# EAGLE design PrimeTime (EAGLE 7.6.0)
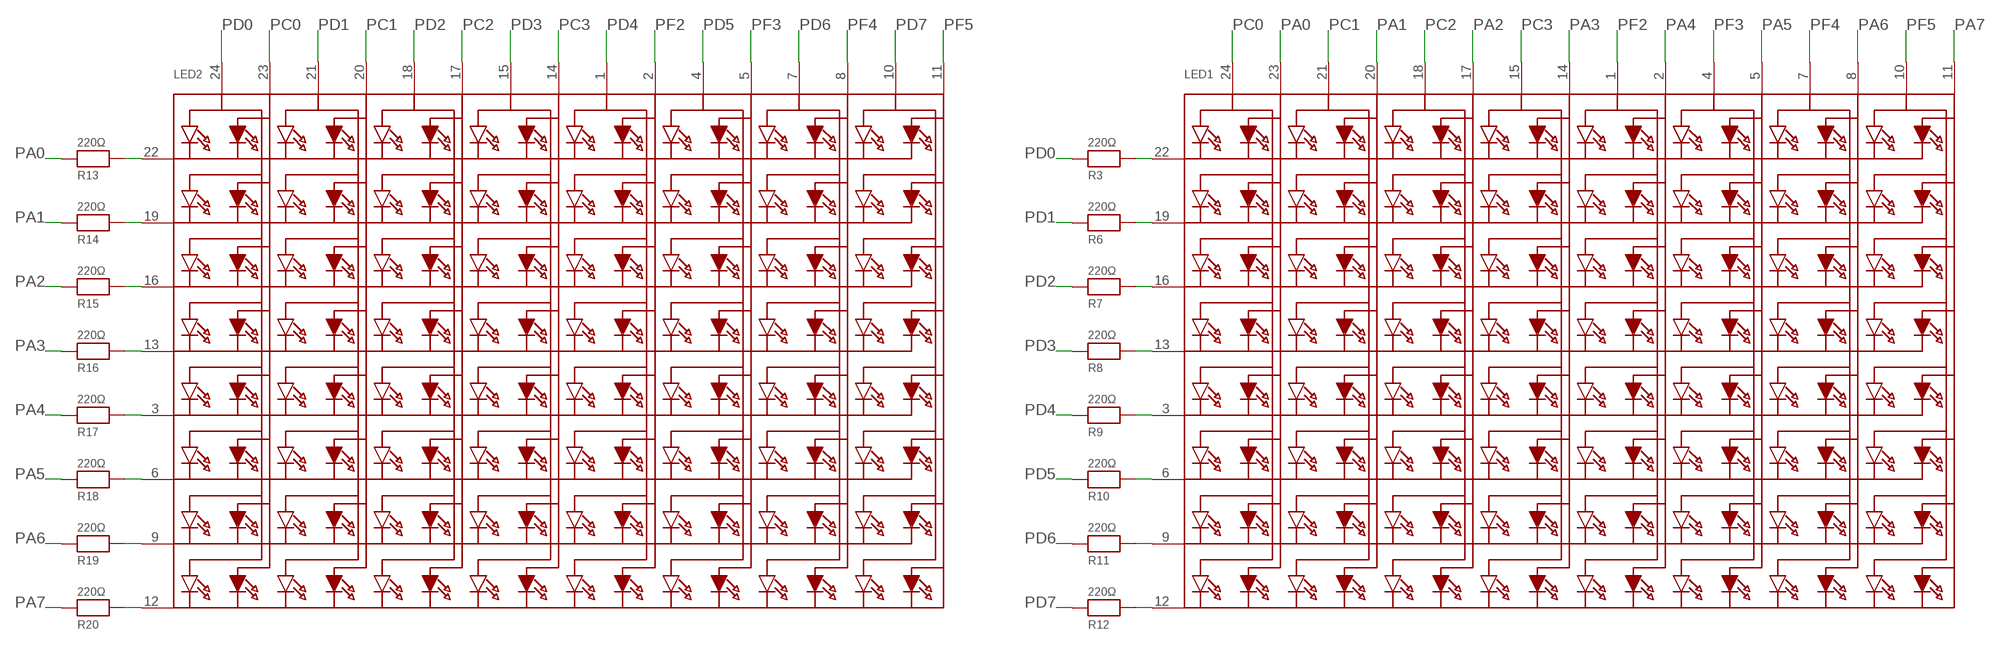
[diagram p0: schematic, sheet 1, part 1 of 2]
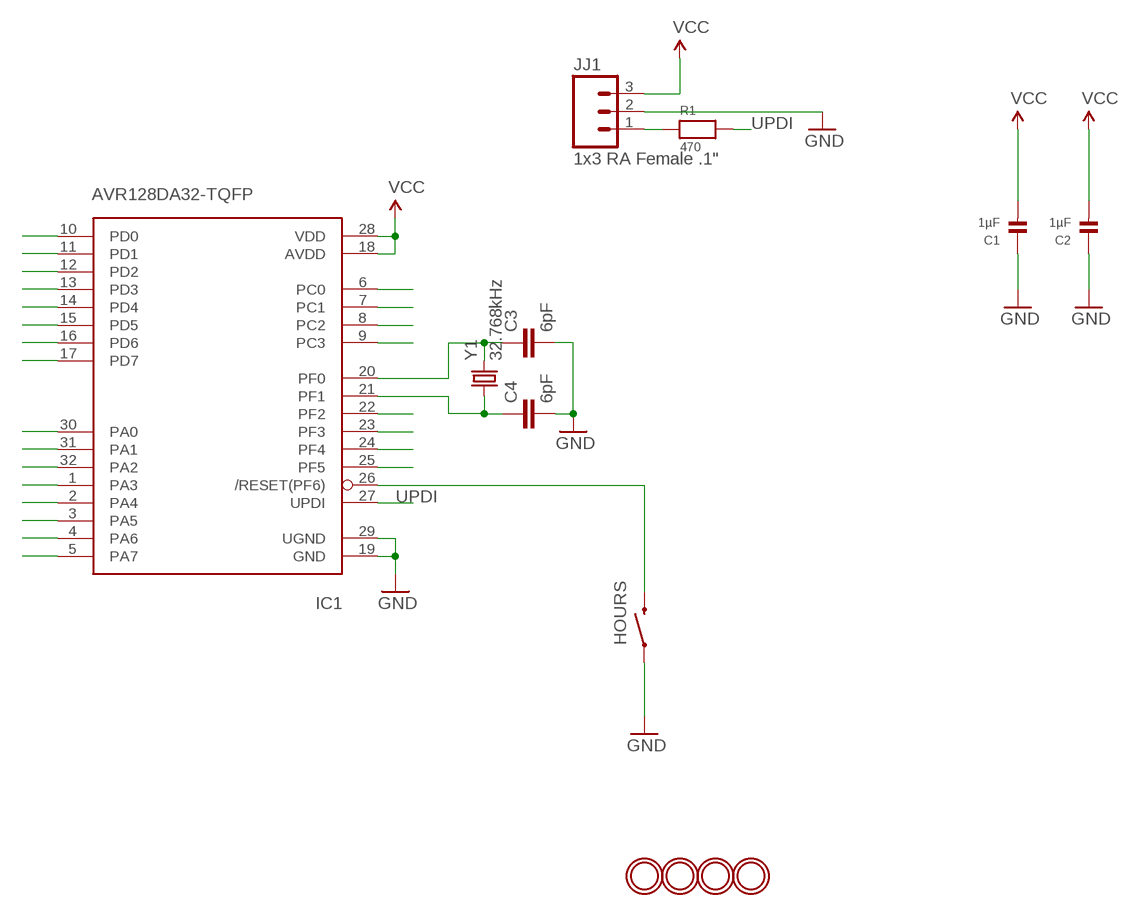
[diagram p1: schematic, sheet 1, part 2 of 2]

## Parts
C1  1µF  CAP_CERAMIC_0805MP  [_0805MP]
C2  1µF  CAP_CERAMIC_0805MP  [_0805MP]
C3  6pF  CAP0805  [0805]
C4  6pF  CAP0805  [0805]
HOURS  SWITCH-MOMENTARY-2SMD-4  [TACTILE_SWITCH_TALL]
IC1  AVR128DA32-TQFP  [TQFP32-08]
JJ1  1x3 RA Female .1"  M03SMD_RA_FEMALE  [1X03_SMD_RA_FEMALE]
LED1  SEGMENT_8X8_BICOLOR_ROWCATHODEMI2A883XX  [SEGMENT_BICOL_BL-M12A883XX]
LED2  SEGMENT_8X8_BICOLOR_ROWCATHODEMI2A883XX  [SEGMENT_BICOL_BL-M12A883XX]
R1  470  RESISTOR_0805MP  [_0805MP]
R3  220Ω  RESISTOR_0805MP  [_0805MP]
R6  220Ω  RESISTOR_0805MP  [_0805MP]
R7  220Ω  RESISTOR_0805MP  [_0805MP]
R8  220Ω  RESISTOR_0805MP  [_0805MP]
R9  220Ω  RESISTOR_0805MP  [_0805MP]
R10  220Ω  RESISTOR_0805MP  [_0805MP]
R11  220Ω  RESISTOR_0805MP  [_0805MP]
R12  220Ω  RESISTOR_0805MP  [_0805MP]
R13  220Ω  RESISTOR_0805MP  [_0805MP]
R14  220Ω  RESISTOR_0805MP  [_0805MP]
R15  220Ω  RESISTOR_0805MP  [_0805MP]
R16  220Ω  RESISTOR_0805MP  [_0805MP]
R17  220Ω  RESISTOR_0805MP  [_0805MP]
R18  220Ω  RESISTOR_0805MP  [_0805MP]
R19  220Ω  RESISTOR_0805MP  [_0805MP]
R20  220Ω  RESISTOR_0805MP  [_0805MP]
U$1  MOUNTINGHOLE2.5  [MOUNTINGHOLE_2.5_PLATED]
U$4  MOUNTINGHOLE2.5  [MOUNTINGHOLE_2.5_PLATED]
U$5  MOUNTINGHOLE2.5  [MOUNTINGHOLE_2.5_PLATED]
U$9  MOUNTINGHOLE2.5  [MOUNTINGHOLE_2.5_PLATED]
Y1  32.768kHz  CRYSTAL3.2X1.5MM  [CRYSTAL-SMD-3.2X1.5MM]

## Nets
GND: C1.1 C2.1 C3.2 C4.2 HOURS.A2 IC1.19(GND) IC1.29(UGND) JJ1.2
N$2: LED2.22(K1) R13.2
N$3: LED2.19(K2) R14.2
N$4: LED2.16(K3) R15.2
N$5: LED2.13(K4) R16.2
N$6: LED2.3(K5) R17.2
N$7: LED2.6(K6) R18.2
N$8: LED2.9(K7) R19.2
N$9: LED2.12(K8) R20.2
N$10: HOURS.B2 IC1.26(/RESET(PF6))
N$11: LED1.22(K1) R3.2
N$12: LED1.19(K2) R6.2
N$13: LED1.16(K3) R7.2
N$14: LED1.13(K4) R8.2
N$15: LED1.3(K5) R9.2
N$16: LED1.6(K6) R10.2
N$17: LED1.9(K7) R11.2
N$18: LED1.12(K8) R12.2
N$40: C4.1 IC1.21(PF1) Y1.P$1
N$42: C3.1 IC1.20(PF0) Y1.P$2
N$78: JJ1.1 R1.1
PA0: IC1.30(PA0) LED1.23(A2) R13.1
PA1: IC1.31(PA1) LED1.20(A4) R14.1
PA2: IC1.32(PA2) LED1.17(A6) R15.1
PA3: IC1.1(PA3) LED1.14(A8) R16.1
PA4: IC1.2(PA4) LED1.2(A10) R17.1
PA5: IC1.3(PA5) LED1.5(A12) R18.1
PA6: IC1.4(PA6) LED1.8(A14) R19.1
PA7: IC1.5(PA7) LED1.11(A16) R20.1
PC0: IC1.6(PC0) LED1.24(A1) LED2.23(A2)
PC1: IC1.7(PC1) LED1.21(A3) LED2.20(A4)
PC2: IC1.8(PC2) LED1.18(A5) LED2.17(A6)
PC3: IC1.9(PC3) LED1.15(A7) LED2.14(A8)
PD0: IC1.10(PD0) LED2.24(A1) R3.1
PD1: IC1.11(PD1) LED2.21(A3) R6.1
PD2: IC1.12(PD2) LED2.18(A5) R7.1
PD3: IC1.13(PD3) LED2.15(A7) R8.1
PD4: IC1.14(PD4) LED2.1(A9) R9.1
PD5: IC1.15(PD5) LED2.4(A11) R10.1
PD6: IC1.16(PD6) LED2.7(A13) R11.1
PD7: IC1.17(PD7) LED2.10(A15) R12.1
PF2: IC1.22(PF2) LED1.1(A9) LED2.2(A10)
PF3: IC1.23(PF3) LED1.4(A11) LED2.5(A12)
PF4: IC1.24(PF4) LED1.7(A13) LED2.8(A14)
PF5: IC1.25(PF5) LED1.10(A15) LED2.11(A16)
UPDI: IC1.27(UPDI) R1.2
VCC: C1.2 C2.2 IC1.18(AVDD) IC1.28(VDD) JJ1.3

## Library data of the parts
C1 C2 = microbuilder:CAP_CERAMIC: Ceramic Capacitors 0402 - 0402 Surface Mount Capacitors 16pF 50V 5% [Digikey: 445-4899-2-ND] 18pF 50V 5% [Digikey: 490-1281-2-ND] 22pF 50V 5% [Digikey: 490-1283-2-ND] 68pF 50V 5% [Digikey: 490-1289-2-ND] 0.1uF 10V 10% [Digikey: 490-1318-2-ND] 1.0uF 6.3V 10% [Digikey: 490-1320-2-ND] 0603 - 0603 Surface Mount Capacitors 16 pF 50V 5% [Digikey: 445-5051-2-ND] 22 pF 50V [Digikey: PCC220ACVTR-ND] 33 pF 50V 5% [Digikey: 490-1415-1-ND] 56pF 50V 5% [Digikey: 490-1421-1-ND] 220pF 50V 5% [Digikey: 445-1285-1-ND] 680 pF 50V 2200 pF 50V 5% C0G [Digikey: 445-1297-1-ND] 5600 pF 100V 5% X7R [Digikey: 478-3711-1-ND] 0.1 µF 25V 10% [Digikey: PCC2277TR-ND] 0.22 µF 16V 10% X7R [Digikey: 445-1318-1-ND] 1.0 µF 25V 10% [Digikey: 445-5146-2-ND] 0603 - RF Specific 3pF 250V +/-0.1pF RF [Digikey: 712-1347-1-ND] 18 pF 250V 5% [Digikey: 478-3505-1-ND or 712-1322-1-ND] 56 pF 250V 5% C0G RF [Digikey: 490-4867-1-ND] 68 pF 250V RF [Digikey: 490-4868-1-ND] 0805 - 0805 Surface Mount Capacitors 220 pF 250V 2% RF Ceramic Capacitor [Digikey: 712-1398-1-ND] 1000 pF 50V 2% NP0 Ceramic Capacitor [Digikey: 478-3760-1-ND] 0.1 µF 25V 10% Ceramic Capacitor [Digikey: PCC1828TR-ND] 1.0 µF 16V 10% Ceramic Capacitor[Digikey: 490-1691-2-ND] 10.0 µF 10V 10% Ceramic Capacitor[Digikey: 709-1228-1-ND] 10.0 uF 16V 10% Ceramic Capacitor [Digikey: 478-5165-2-ND] 47 uF 6.3V 20% Ceramic Capacitor [Digikey: 587-1779-1-ND or 399-5506-1-ND] 1206 - 1206 Surface Mount Capacitors 47uF 10V 20% Ceramic Capacitor [Digikey: 490-5528-1-ND or 399-5508-1-ND or 445-6010-1-ND] 100uF 6.3V -20%, +80% Y5V Ceramic Capacitor (Digikey: 490-4512-1-ND, Mouser: 81-GRM31CF50J107ZE1L)
C3 C4 = SparkFun-Capacitors:CAP: Capacitor Standard 0603 ceramic capacitor, and 0.1" leaded capacitor.
HOURS = SparkFun-Electromechanical:SWITCH-MOMENTARY-2: Various NO switches- pushbuttons, reed, etc; PROD_ID: SWCH-11966
IC1 = technoblogy:AVR128DA32: ATmega32u2 Pin compatible with the atmega8u2, atmega16u2 and atmega32u2 8, 16 or 32 K flash, 1K RAM, 512b EEPROM 8 bit and 16 bit timer (5 PWM total) UART, SPI (no I2C!) USB with 4 endpoints, LUFA compatible 22 I/O lines, analog comparator (no ADC!) Comes with DFU bootloader burned in!
JJ1 = SparkFun-Connectors:M03: Header 3 Standard 3-pin 0.1" header. Use with straight break away headers (SKU : PRT-00116), right angle break away headers (PRT-00553), swiss pins (PRT-00743), machine pins (PRT-00117), and female headers (PRT-00115). Molex polarized connector foot print use with SKU : PRT-08232 with associated crimp pins and housings.; PROD_ID: CONN-10926
LED1 LED2 = adafruit:SEGMENT_8X8_BICOLOR_ROWCATHODE: 8x8 Bi-Color LED Segment Displays: Row = Cathode 1.2" Bi-Color 8x8 Matrix, 3.0mm Square LEDs - BL-M12A883XX
R1 R3 R6-R20 = microbuilder:RESISTOR: Resistors 0402 - 0402 Surface Mount Package 22 Ohm 1% 1/16W [Digikey: 311-22.0LRTR-ND] 33 Ohm 5% 1/16W 1.0K 5% 1/16W 1.5K 5% 1/16W 2.0K 1% 1/16W 10.0K 1% 1/16W [Digikey: 311-10.0KLRTR-ND] 10.0K 5% 1/16W [Digikey: RMCF0402JT10K0TR-ND] 12.1K 1% 1/16W [Digikey: 311-22.0LRTR-ND] 100.0K 5% 1/16W 0603 - 0603 Surface Mount Package 0 Ohm 1/10 Watt 1% Resistor 15 Ohm 1/10 Watt 1% Resistor 33 Ohm 1/10 Watt 1% Resistor 49.9 Ohm 1/10 Watt 1% Resistor 100 Ohm 1/10 Watt 1% Resistor 150 Ohm 1/10 Watt 1% Resistor 240 Ohm 1/10 Watt 1% Resistor 390 Ohm 1/10 Watt 1% Resistor 560 Ohm 1/10 Watt 1% Resistor 680 Ohm 1/10 Watt 1% Resistor 750 Ohm 1/10 Watt 1% Resistor 1.0K Ohm 1/10 Watt 1% Resistor 1.5K Ohm 1/10 Watt 1% Resistor 2.0K Ohm 1/10 Watt 1% Resistor 2.2K Ohm 1/10 Watt 1% Resistor 3.3K Ohm 1/10 Watt 1% Resistor 4.7K Ohm 1/10 Watt 1% Resistor 10.0K Ohm 1/10 Watt 1% Resistor 12.0K Ohm 1/10 Watt 1% Resistor 12.1K Ohm 1/10 Watt 1% Resistor 20.0K Ohm 1/10 Watt 1% Resistor 33.0K Ohm 1/10 Watt 1% Resistor 100.0K Ohm 1/10 Watt 1% Resistor 0805 - 0805 Surface Mount Package 0 Ohm 1/8 Watt 1% Resistor 33 Ohm 1/8 Watt 1% Resistor 100 Ohm 1/8 Watt 1% Resistor 150 Ohm 1/8 Watt 1% Resistor 200 Ohm 1/8 Watt 1% Resistor 240 Ohm 1/8 Watt 1% Resistor 330 Ohm 1/8 Watt 1% Resistor 390 Ohm 1/8 Watt 1% Resistor 470 Ohm 1/8 Watt 1% Resistor 1.0K Ohm 1/8 Watt 1% Resistor 1.5K Ohm 1/8 Watt 1% Resistor 2.0K Ohm 1/8 Watt 1% Resistor 4.7K Ohm 1/8 Watt 1% Resistor 5.1K Ohm 1/8 Watt 1% Resistor 5.6K Ohm 1/8 Watt 1% Resistor 10.0K Ohm 1/8 Watt 1% Resistor 22.0K Ohm 1/8 Watt 1% Resistor 33.0K Ohm 1/8 Watt 1% Resistor 100K Ohm 1/8 Watt 1% Resistor 1206 - 1206 Surface Mount Package 2012 - 2010 Surface Mount Package 0.11 Ohm 1/2 Watt 1% Resistor - Digikey: RHM.11UCT-ND
U$1 U$4 U$5 U$9 = microbuilder:MOUNTINGHOLE: Mounting Hole For #2 screws (0.086"/2.18mm width, 0.094"/2.4mm hole) use 2.5mm; BOM: EXCLUDE
Y1 = SparkFun-FreqCtrl:CRYSTAL: Various standard crystals. Proven footprints.; PROD_ID: XTAL-13062

## Net classes
0 default: width 0.152 mm, drill 0.305 mm, clearance 0.152 mm

## Board
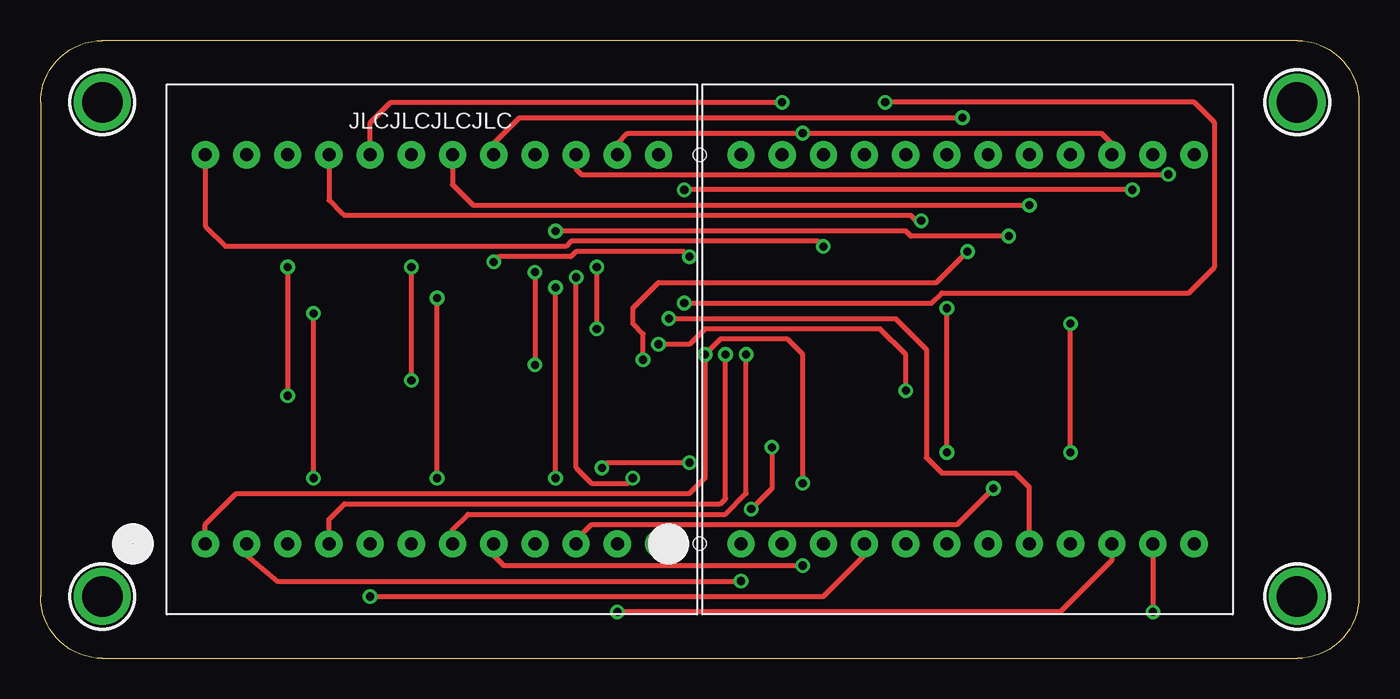
[diagram p2: board, top side]
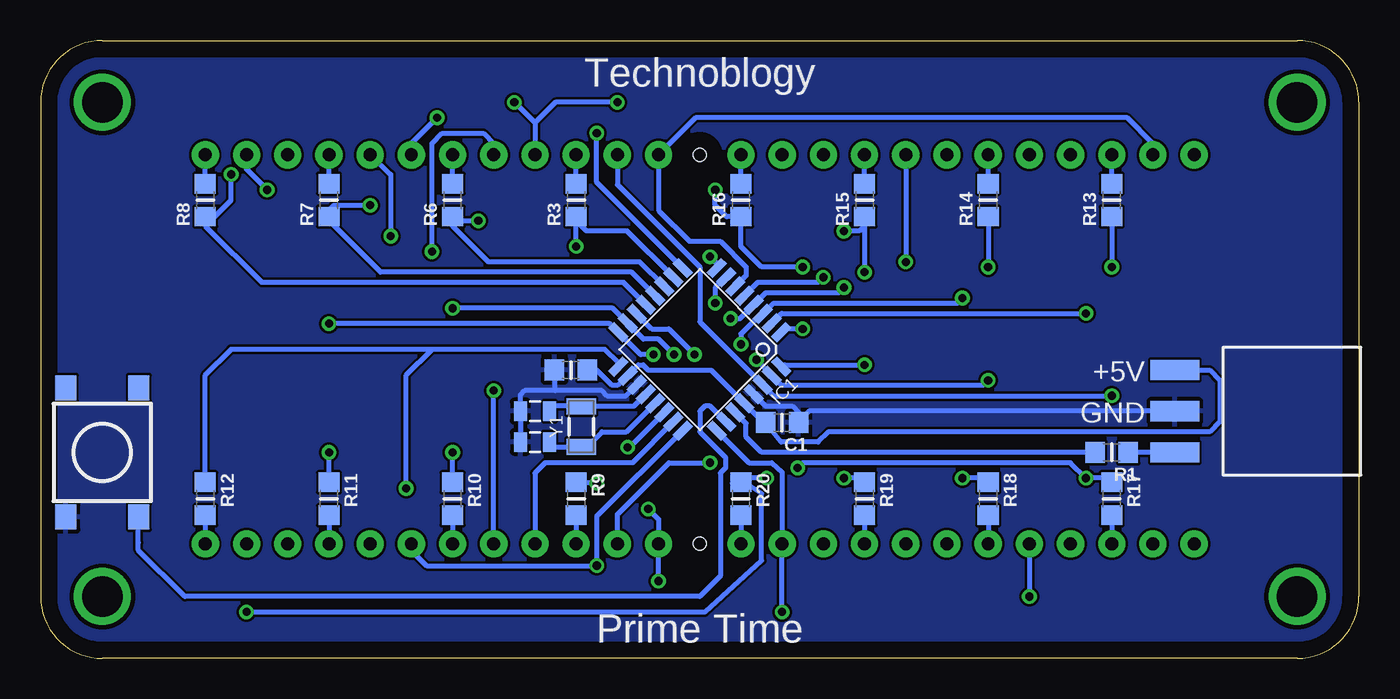
[diagram p3: board, bottom side, seen from below]

Size 81.28 x 38.1 mm. Coordinates in mm from the lower left corner, seen from the top.
Outline: 0,34.29 arc-90 3.81,38.1 77.47,38.1 arc-90 81.28,34.29 81.28,3.81 arc-90 77.47,0 3.81,0 arc-90 0,3.81 0,34.29
Copper layers (1*16): Top 0.035mm / dielectric 1.5mm / Bottom 0.035mm
Design rules "default *": minimum track width 10mil, minimum drill 24mil, track to track 6mil, track to pad 6mil, pad to pad 6mil, via to via 6mil, smd to smd 6mil, copper to edge 40mil, drill to drill 8mil, minimum pad ring 10mil, minimum via ring 8mil, stop-mask expansion 4mil, vias tented up to drill 25mil, thermal gap 10mil
Holes 0.8 mm at 40.64,7.06 40.64,31.04

### Footprints (pad centres in the part's own frame; a part is rotated, then mirrored left to right if it is on the bottom)
_0805MP = smd 1.2 x 1.3: 1 -1.016,0; 2 1.016,0
0805 = smd 0.8 x 1.2: 1 -0.9,0; 2 0.9,0
TACTILE_SWITCH_TALL = smd 1.55 x 1.3: A1 -3.975,-2.25; A2 3.975,-2.25; B1 -3.975,2.25; B2 3.975,2.25
TQFP32-08 = smd 1.27 x 0.508: 1 -4.293,2.8; 2 -4.293,2; 3 -4.293,1.2; 4 -4.293,0.4; 5 -4.293,-0.4; 6 -4.293,-1.2; 7 -4.293,-2; 8 -4.293,-2.8; 17 4.293,-2.8; 18 4.293,-2; 19 4.293,-1.2; 20 4.293,-0.4; 21 4.293,0.4; 22 4.293,1.2; 23 4.293,2; 24 4.293,2.8 | smd 0.508 x 1.27: 9 -2.8,-4.293; 10 -2,-4.293; 11 -1.2,-4.293; 12 -0.4,-4.293; 13 0.4,-4.293; 14 1.2,-4.293; 15 2,-4.293; 16 2.8,-4.293; 25 2.8,4.293; 26 2,4.293; 27 1.2,4.293; 28 0.4,4.293; 29 -0.4,4.293; 30 -1.2,4.293; 31 -2,4.293; 32 -2.8,4.293
1X03_SMD_RA_FEMALE = smd 1.25 x 3: 1 -2.54,7.225; 2 0,7.225; 3 2.54,7.225
SEGMENT_BICOL_BL-M12A883XX = drill 0.8 pad 1.676: 1 -13.97,-12; 2 -11.43,-12; 3 -8.89,-12; 4 -6.35,-12; 5 -3.81,-12; 6 -1.27,-12; 7 1.27,-12; 8 3.81,-12; 9 6.35,-12; 10 8.89,-12; 11 11.43,-12; 12 13.97,-12; 13 13.97,12; 14 11.43,12; 15 8.89,12; 16 6.35,12; 17 3.81,12; 18 1.27,12; 19 -1.27,12; 20 -3.81,12; 21 -6.35,12; 22 -8.89,12; 23 -11.43,12; 24 -13.97,12
MOUNTINGHOLE_2.5_PLATED = drill 2.5 pad 3.2: P$1 0,0
CRYSTAL-SMD-3.2X1.5MM = smd 1 x 1.8: P$1 -1.25,0; P$2 1.25,0

### Placement (x,y rotation side)
C1  35.56,14.54 180 bottom
C2  48.58,17.78 0 bottom
C3  50.8,15.24 180 bottom
C4  50.8,13.34 180 bottom
HOURS  77.47,12.7 270 bottom
IC1  40.64,19.05 225 bottom
JJ1  4.13,15.24 90 bottom
LED1  57.15,19.05 0 top
LED2  24.13,19.05 0 top
R1  15.24,12.7 180 bottom
R3  48.26,28.26 90 bottom
R6  55.88,28.26 90 bottom
R7  63.5,28.26 90 bottom
R8  71.12,28.26 90 bottom
R9  48.26,9.84 270 bottom
R10  55.88,9.84 270 bottom
R11  63.5,9.84 270 bottom
R12  71.12,9.84 270 bottom
R13  15.24,28.26 90 bottom
R14  22.86,28.26 90 bottom
R15  30.48,28.26 90 bottom
R16  38.1,28.26 90 bottom
R17  15.24,9.84 270 bottom
R18  22.86,9.84 270 bottom
R19  30.48,9.84 270 bottom
R20  38.1,9.84 270 bottom
U$1  77.47,34.29 0 top
U$4  77.47,3.81 0 top
U$5  3.81,3.81 0 top
U$9  3.81,34.29 0 top
Y1  47.94,14.29 90 bottom

### Tracks (layer width: path | path; a pad name or v marks a point on that pad's centre or on a via)
GND
  Bottom 0.305: C4.2 C3.2 51.7,16.25 51.44,16.51 49.53,16.51 | 49.53,16.51 46.67,16.51 46.35,16.19 45.2,16.19 IC1.19 | JJ1.2 33.91,15.24 C1.1 34.54,15.18 34.92,15.56 36.58,15.56 IC1.29 | C2.1 49.59,16.57 49.53,16.51
  pour Bottom: 0,38.1 0,0 81.28,0 81.28,38.1
N$2
  Bottom 0.305: R13.2 LED2.22
N$3
  Bottom 0.305: R14.2 LED2.19
N$4
  Bottom 0.305: R15.2 LED2.16
N$5
  Bottom 0.305: R16.2 LED2.13
N$6
  Bottom 0.305: R17.2 LED2.3
N$7
  Bottom 0.305: R18.2 LED2.6
N$8
  Bottom 0.305: R19.2 LED2.9
N$9
  Bottom 0.305: R20.2 LED2.12
N$10
  Bottom 0.305: IC1.26 39.05,14.6 40.01,15.56 40.32,15.56 40.64,15.24 40.64,13.97 39.05,12.38 39.05,11.75 39.37,11.43 39.37,5.08 40.64,3.81 72.39,3.81 75.25,6.67 75.25,7.12 HOURS.B2
N$11
  Bottom 0.305: R3.2 LED1.22
N$12
  Bottom 0.305: R6.2 LED1.19
N$13
  Bottom 0.305: R7.2 LED1.16
N$14
  Bottom 0.305: R8.2 LED1.13
N$15
  Bottom 0.305: R9.2 LED1.3
N$16
  Bottom 0.305: R10.2 LED1.6
N$17
  Bottom 0.305: R11.2 LED1.9
N$18
  Bottom 0.305: R12.2 LED1.12
N$40
  Bottom 0.305: C4.1 49.88,13.04 Y1.P$1 47.6,13.04 46.67,13.97 45.15,13.97 IC1.21
N$42
  Bottom 0.305: IC1.20 44.72,15.54 Y1.P$2 47.96,15.56 49.58,15.56 C3.1
N$78
  Bottom 0.305: JJ1.1 R1.1
PA0  (via drill 0.5)
  Top 0.305: v15.24,24.13 v15.24,16.19
  Bottom 0.305: v15.24,16.19 36.09,16.19 IC1.30 40.64,20.75 40.64,24.13 45.72,29.21 LED1.23 | R13.1 v15.24,24.13
PA1  (via drill 0.5)
  Top 0.305: v22.86,24.13 v22.86,17.14 | v37.15,18.41 37.15,20 36.51,20.64 36.51,21.59 38.1,23.18 55.24,23.18 v57.15,25.08
  Bottom 0.305: IC1.31 35.91,17.14 | R14.1 v22.86,24.13 | IC1.31 36.19,17.46 v37.15,18.41 | v57.15,25.08 57.15,31.75 56.52,32.38 53.98,32.38 53.34,31.75 LED1.20 | v22.86,17.14 23.18,16.83 35.56,16.83 36.16,17.43 IC1.31
PA2  (via drill 0.5)
  Top 0.305: v30.48,23.81 v30.48,18.1 | v59.69,26.04 53.66,26.04 53.34,26.35 v31.75,26.35
  Bottom 0.305: IC1.32 35.41,18.1 v30.48,18.1 | R15.1 30.48,26.67 | 30.48,26.67 v30.48,23.81 | LED1.17 59.69,29.84 v59.69,26.04 | 30.48,26.67 30.8,26.35 v31.75,26.35
PA3  (via drill 0.5)
  Top 0.305: v34.29,24.13 v34.29,20.32 | v67.31,28.89 v39.69,28.89
  Bottom 0.305: IC1.1 35.41,20.32 v34.29,20.32 | R16.1 38.04,27.24 | LED1.14 68.58,30.16 v67.31,28.89 | R16.1 38.99,27.24 39.69,27.94 v39.69,28.89 | v34.29,24.13 36.83,24.13 38.1,25.4 R16.1
PA4  (via drill 0.5)
  Top 0.305: v16.83,11.11 v16.83,21.27 | v40.01,12.06 34.92,12.06 v34.61,11.75
  Bottom 0.305: IC1.2 35.59,21.27 v16.83,21.27 | LED1.2 45.72,8.89 42.55,12.06 v40.01,12.06 | v34.61,11.75 34.29,12.06 17.78,12.06 v16.83,11.11 15.49,11.11 R17.1
PA5  (via drill 0.5)
  Top 0.305: v24.45,11.11 v24.45,22.23 | v53.34,16.51 53.34,18.73 51.75,20.32 40.96,20.32 40.01,19.37 v38.1,19.37
  Bottom 0.305: LED1.5 v53.34,16.51 | v38.1,19.37 38.1,20 36.87,21.24 IC1.3 36.09,21.91 24.77,21.91 v24.45,22.23 | R18.1 23.11,11.11 v24.45,11.11
PA6  (via drill 0.5)
  Top 0.305: v31.75,11.11 v31.75,22.86 | v38.73,20.95 52.7,20.95 54.61,19.05 54.61,12.38 55.56,11.43 60.07,11.43 60.96,10.54 LED1.8
  Bottom 0.305: R19.1 30.48,10.79 30.8,11.11 v31.75,11.11 | IC1.4 37.32,21.73 | v38.73,20.95 38.17,20.95 IC1.4 | v31.75,22.86 32.07,22.54 36.58,22.54 IC1.4
PA7  (via drill 0.5)
  Top 0.305: v33.02,23.5 33.02,11.75 33.97,10.79 36.2,10.79 v36.51,11.11 | LED1.11 v68.58,2.86
  Bottom 0.305: R20.1 38.08,11.05 38.65,10.79 | v68.58,2.86 40.32,2.86 36.83,6.03 36.83,10.16 37.78,10.79 R20.1 | v36.51,11.11 37.85,11.11 R20.1 | v33.02,23.5 33.34,23.18 37.08,23.18 IC1.5
PC0
  Bottom 0.305: LED2.23 12.7,31.75 14.29,33.34 40.89,33.34 LED1.24 43.18,27.62 41.27,25.72 39.37,25.72 37.78,24.13 37.78,23.61 IC1.6
PC1  (via drill 0.5)
  Top 0.305: LED2.20 20.32,33.02 21.59,34.29 v45.72,34.29 | v39.69,21.91 54.93,21.91 55.56,22.54 70.8,22.54 72.39,24.13 72.39,33.02 71.12,34.29 v52.07,34.29
  Bottom 0.305: IC1.7 39.05,23.5 39.69,22.86 v39.69,21.91 | v52.07,34.29 50.8,33.02 | 50.8,33.02 LED1.21 | v45.72,34.29 49.53,34.29 50.8,33.02
PC2  (via drill 0.5)
  Top 0.305: LED2.17 27.94,31.75 29.53,33.34 v56.83,33.34 | v40.01,24.77 39.69,25.08 33.02,25.08 32.7,24.77 28.26,24.77 v27.94,24.45
  Bottom 0.305: v56.83,33.34 58.42,31.75 LED1.18 | LED2.17 v27.94,24.45 | IC1.8 39.59,24.34 v40.01,24.77
PC3  (via drill 0.5)
  Top 0.305: LED2.14 35.56,31.75 36.2,32.38 v46.99,32.38 65.41,32.38 66.04,31.75 LED1.15
  Bottom 0.305: v46.99,32.38 46.99,29.36 IC1.9
PD0  (via drill 0.5)
  Top 0.305: LED2.24 10.16,26.67 11.43,25.4 32.38,25.4 32.7,25.72 47.94,25.72 v48.26,25.4
  Bottom 0.305: IC1.10 45.11,26.35 47.62,26.35 48.26,26.99 R3.1 v48.26,25.4
PD1  (via drill 0.5)
  Top 0.305: LED2.21 17.78,28.26 18.57,27.46 18.73,27.3 53.66,27.3 53.98,26.99 v54.29,26.99
  Bottom 0.305: IC1.11 44.34,24.45 53.66,24.45 55.88,26.67 55.88,26.99 | R6.1 55.88,26.99 | 55.88,26.99 v54.29,26.99
PD2  (via drill 0.5)
  Top 0.305: LED2.18 25.4,29.21 26.67,27.94 v60.96,27.94
  Bottom 0.305: IC1.12 44.84,23.81 60.33,23.81 63.5,26.99 R7.1 63.82,27.3 63.18,27.94 v60.96,27.94
PD3  (via drill 0.5)
  Top 0.305: v69.53,29.84 33.34,29.84 33.02,30.16 LED2.15
  Bottom 0.305: IC1.13 45.33,23.18 67.63,23.18 71.12,26.67 | R8.1 71.12,26.67 | 71.12,26.67 69.53,28.26 v69.53,29.84
PD4  (via drill 0.5)
  Top 0.305: LED2.1 10.16,8.26 12.06,10.16 40.01,10.16 40.96,11.11 v40.96,18.73 41.91,19.68 46.04,19.68 46.99,18.73 v46.99,10.79
  Bottom 0.305: 44.41,21.24 IC1.14 43.61,20.32 42.55,20.32 v40.96,18.73 | R9.1 47.05,10.86 v46.99,10.79
PD5  (via drill 0.5)
  Top 0.305: v55.88,12.7 v55.88,21.59 | LED2.4 17.78,8.57 18.73,9.53 41.91,9.53 42.23,9.84 v42.23,18.73
  Bottom 0.305: IC1.15 46.01,21.59 v55.88,21.59 | R10.1 v55.88,12.7 | IC1.15 45.09,20.64 | v42.23,18.73 43.18,19.68 44.13,19.68 44.13,19.71 IC1.15
PD6  (via drill 0.5)
  Top 0.305: v63.5,12.7 v63.5,20.64 | LED2.7 25.4,7.94 26.35,8.89 42.23,8.89 43.5,10.16 v43.5,18.73
  Bottom 0.305: v63.5,20.64 46.19,20.64 IC1.16 44.28,18.73 v43.5,18.73 | R11.1 v63.5,12.7
PD7  (via drill 0.5)
  Top 0.305: LED2.10 33.02,7.3 33.97,8.26 56.52,8.26 v58.74,10.48
  Bottom 0.305: 57.15,19.05 46.51,19.05 45.66,18.2 IC1.17 | 57.15,19.05 69.53,19.05 71.12,17.46 R12.1 | v58.74,10.48 58.74,17.46 57.15,19.05
PF2  (via drill 0.5)
  Top 0.305: LED2.2 12.7,6.35 14.61,4.76 v43.18,4.76 | v45.09,13.02 45.09,10.48 v43.81,9.21
  Bottom 0.305: v43.18,4.76 LED1.1 43.18,8.57 v43.81,9.21 | 42.94,15.17 IC1.22 44.98,13.02 v45.09,13.02
PF3  (via drill 0.5)
  Top 0.305: v20.32,3.81 48.26,3.81 50.8,6.35 LED1.4
  Bottom 0.305: LED2.5 v20.32,3.81 | 42.26,14.57 IC1.23 44.77,12.09 44.77,12.06 50.16,12.06 50.8,11.43 LED1.4
PF4  (via drill 0.5)
  Top 0.305: LED2.8 27.94,6.35 28.57,5.71 v46.99,5.71
  Bottom 0.305: 41.91,13.65 41.91,13.97 41.84,14.04 IC1.24 46.99,8.74 v46.99,5.71 57.47,5.71 58.42,6.67 LED1.7
PF5  (via drill 0.5)
  Top 0.305: LED1.10 66.04,6.03 62.87,2.86 v35.56,2.86
  Bottom 0.305: v35.56,2.86 LED2.11 35.56,11.49 36.2,12.06 37.62,12.06 IC1.25 39.75,14.04
UPDI
  Bottom 0.305: R1.2 36.83,12.7 37.78,13.65 37.78,14.49 IC1.27
VCC
  Bottom 0.305: C2.2 46.99,17.78 46.04,16.83 45.72,16.83 45.12,17.43 IC1.18 44.42,18.1 44.13,18.1 43.81,17.78 39.94,17.78 IC1.28 36.7,14.54 C1.2 35.62,13.34 33.34,13.34 32.7,13.97 9.21,13.97 8.57,14.61 8.57,17.14 9.21,17.78 JJ1.3

### Text on the board
tPlace: JLCJLCJLCJLC
bPlace: Technoblogy | +5V | GND | Prime Time